# EAGLE schematic 3.3 (EAGLE 9.3.0)

## Sheet 1 of 3
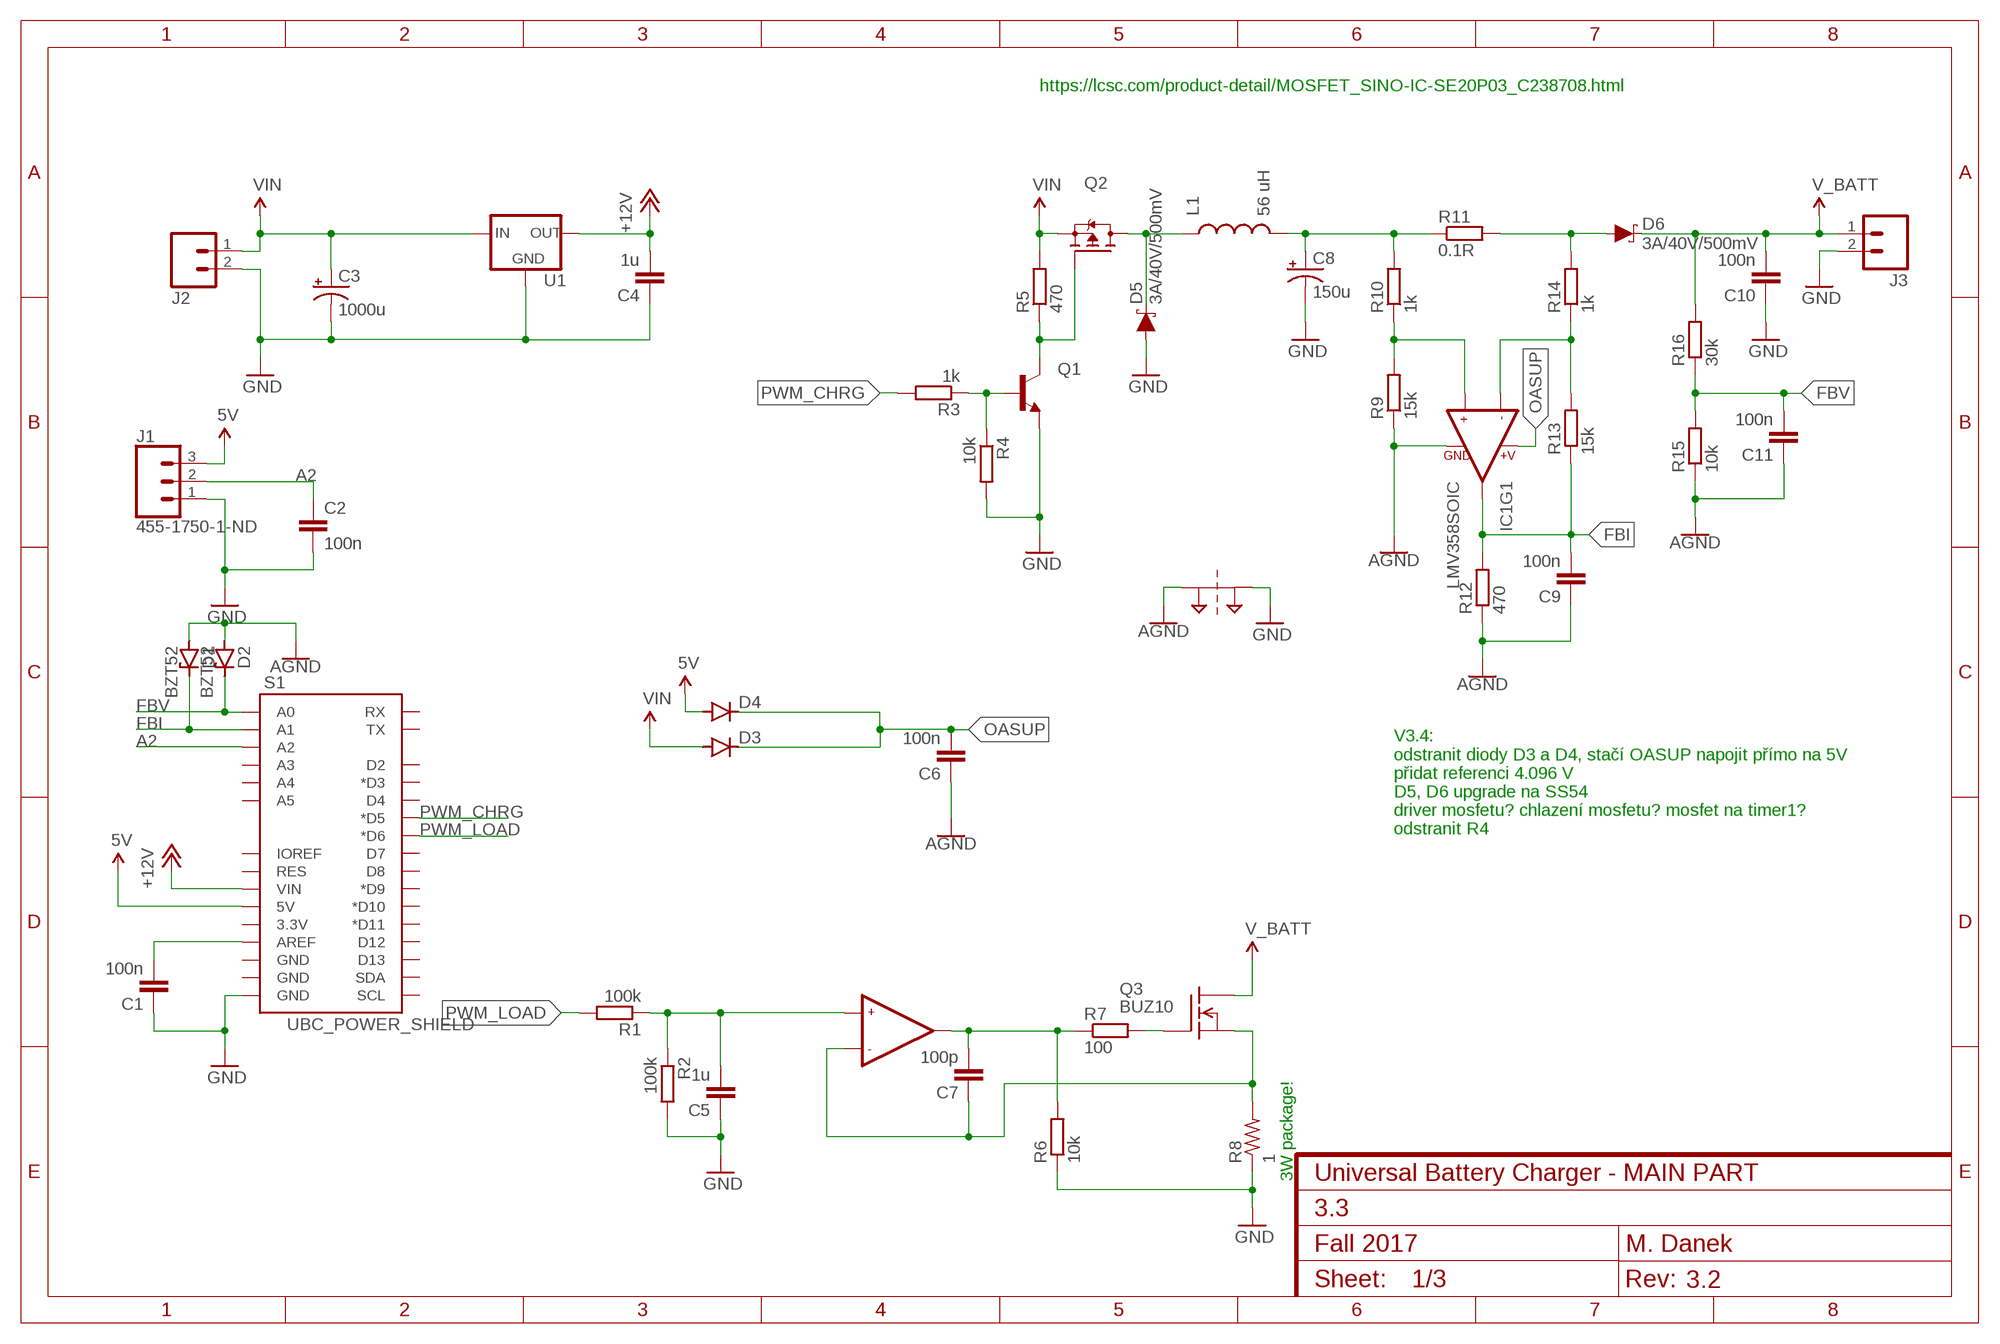
[diagram p0: schematic, sheet 1]
FRAME1 (FRAME-A4L): CNAME: Universal Battery Charger - MAIN PART; CREVISION: 3.2; DESIGNER: M. Danek

### Parts
C1  100n  C-EUC1206  [C1206]
C2  100n  C-EUC1206  [C1206]
C3  1000u  CAP_POLPTH4  [CPOL-RADIAL-1000UF-25V]
C4  1u  C-EUC1206  [C1206]
C5  1u  C-EUC1206  [C1206]
C6  100n  C-EUC1206  [C1206]
C7  100p  C-EUC1206  [C1206]
C8  150u  CAP_POLPTH1  [CPOL-RADIAL-100UF-25V]
C9  100n  C-EUC1206  [C1206]
C10  100n  C-EUC1206  [C1206]
C11  100n  C-EUC1206  [C1206]
D1  BZT52  ZENER-DIODESOD80C  [SOD80C]
D2  BZT52  ZENER-DIODESOD80C  [SOD80C]
D3  DIODE-MINIMELF  [MINIMELF]
D4  DIODE-MINIMELF  [MINIMELF]
D5  3A/40V/500mV  DIODE-SCHOTTKY-B340A  [SMA-DIODE]
D6  3A/40V/500mV  DIODE-SCHOTTKY-B340A  [SMA-DIODE]
IC1  LMV358SOIC  [SO08]
J1  455-1750-1-ND  CONN_03  [1X03]
J2  M025MM  [SCREWTERMINAL-5MM-2]
J3  M025MM  [SCREWTERMINAL-5MM-2]
L1  56 uH  INDUCTORPWR  [CDRH125]
PT1  2PT_GND_TIE  [2PT_GND_TIE]
Q1  2N3904-MMBT  [SOT23]
Q2  FDD4141TO252  [TO252]
Q3  BUZ10  [TO220]
R1  100k  R-EU_R1206  [R1206]
R2  100k  R-EU_R1206  [R1206]
R3  1k  R-EU_R1206  [R1206]
R4  10k  R-EU_R1206  [R1206]
R5  470  R-EU_R1206  [R1206]
R6  10k  R-EU_R1206  [R1206]
R7  100  R-EU_R1206  [R1206]
R8  1  R-US_0617/22  [0617/22]
R9  15k  R-EU_R1206  [R1206]
R10  1k  R-EU_R1206  [R1206]
R11  0.1R  R-EU_0414/15  [0414/15]
R12  470  R-EU_R1206  [R1206]
R13  15k  R-EU_R1206  [R1206]
R14  1k  R-EU_R1206  [R1206]
R15  10k  R-EU_R1206  [R1206]
R16  30k  R-EU_R1206  [R1206]
S1  UBC_POWER_SHIELD  [UBC_POWER]
U1  V_REG_78XXSIDE  [78XXL]

### Nets
5V: D4.A J1.3 S1.5V ; also sheet 2,3
+12V: C4.2 S1.VIN U1.OUT
A2: C2.1 J1.2 S1.A2
AGND: C6.1 C9.1 C11.1 D1.A D2.A IC1.4(GND) PT1.P$1 R9.1 R12.1 R15.1
FBI: C9.2 D1.C IC1.1(OUT1) R12.2 R13.1 S1.A1
FBV: C11.2 D2.C R15.2 R16.1 S1.A0
GND: C1.1 C2.2 C3.2(-) C4.1 C5.1 C8.2(-) C10.1 D5.A J1.1 J2.2 J3.2 PT1.P$2 Q1.2(E) R2.2 R4.2 R6.1 R8.1 S1.GND@0(GND) U1.GND ; also sheet 2,3
N$6: C8.1(+) L1.2 R10.2 R11.1
N$7: C1.2 S1.AREF
N$10: IC1.3(+IN1) R9.2 R10.1
N$11: IC1.2(-IN1) R13.2 R14.1
N$14: D5.C L1.1 Q2.3(D)
N$15: D6.A R11.2 R14.2
N$21: C7.2 IC1.7(OUT2) R6.2 R7.1
N$23: Q1.3(C) Q2.1(G) R5.1
N$24: Q3.1(G) R7.2
N$25: C7.1 IC1.6(-IN2) Q3.3(S) R8.2
N$26: C5.2 IC1.5(+IN2) R1.1 R2.1
N$31: Q1.1(B) R3.1 R4.1
OASUP: C6.2 D3.C D4.C IC1.8(+V)
PWM_CHRG: R3.2 S1.D5(*D5)
PWM_LOAD: R1.2 S1.D6(*D6)
V_BATT: C10.2 D6.C J3.1 Q3.2(D) R16.2
VIN: C3.1(+) D3.A J2.1 Q2.2(S) R5.2 U1.IN
Unconnected: S1.3.3V S1.A3 S1.A4 S1.A5 S1.D2 S1.D3(*D3) S1.D4 S1.D7 S1.D8 S1.D9(*D9) S1.D10(*D10) S1.D11(*D11) S1.D12 S1.D13 S1.GND@1(GND) S1.GND@2(GND) S1.IOREF S1.RES S1.RX S1.SCL S1.SDA S1.TX

### Notes on the sheet
- https://lcsc.com/product-detail/MOSFET_SINO-IC-SE20P03_C238708.html
- V3.4: 
  odstranit diody D3 a D4, stačí OASUP napojit přímo na 5V
  přidat referenci 4.096 V
  D5, D6 upgrade na SS54
  driver mosfetu? chlazení mosfetu? mosfet na timer1?
  odstranit R4
- 3W package!
- Fall 2017

## Sheet 2 of 3
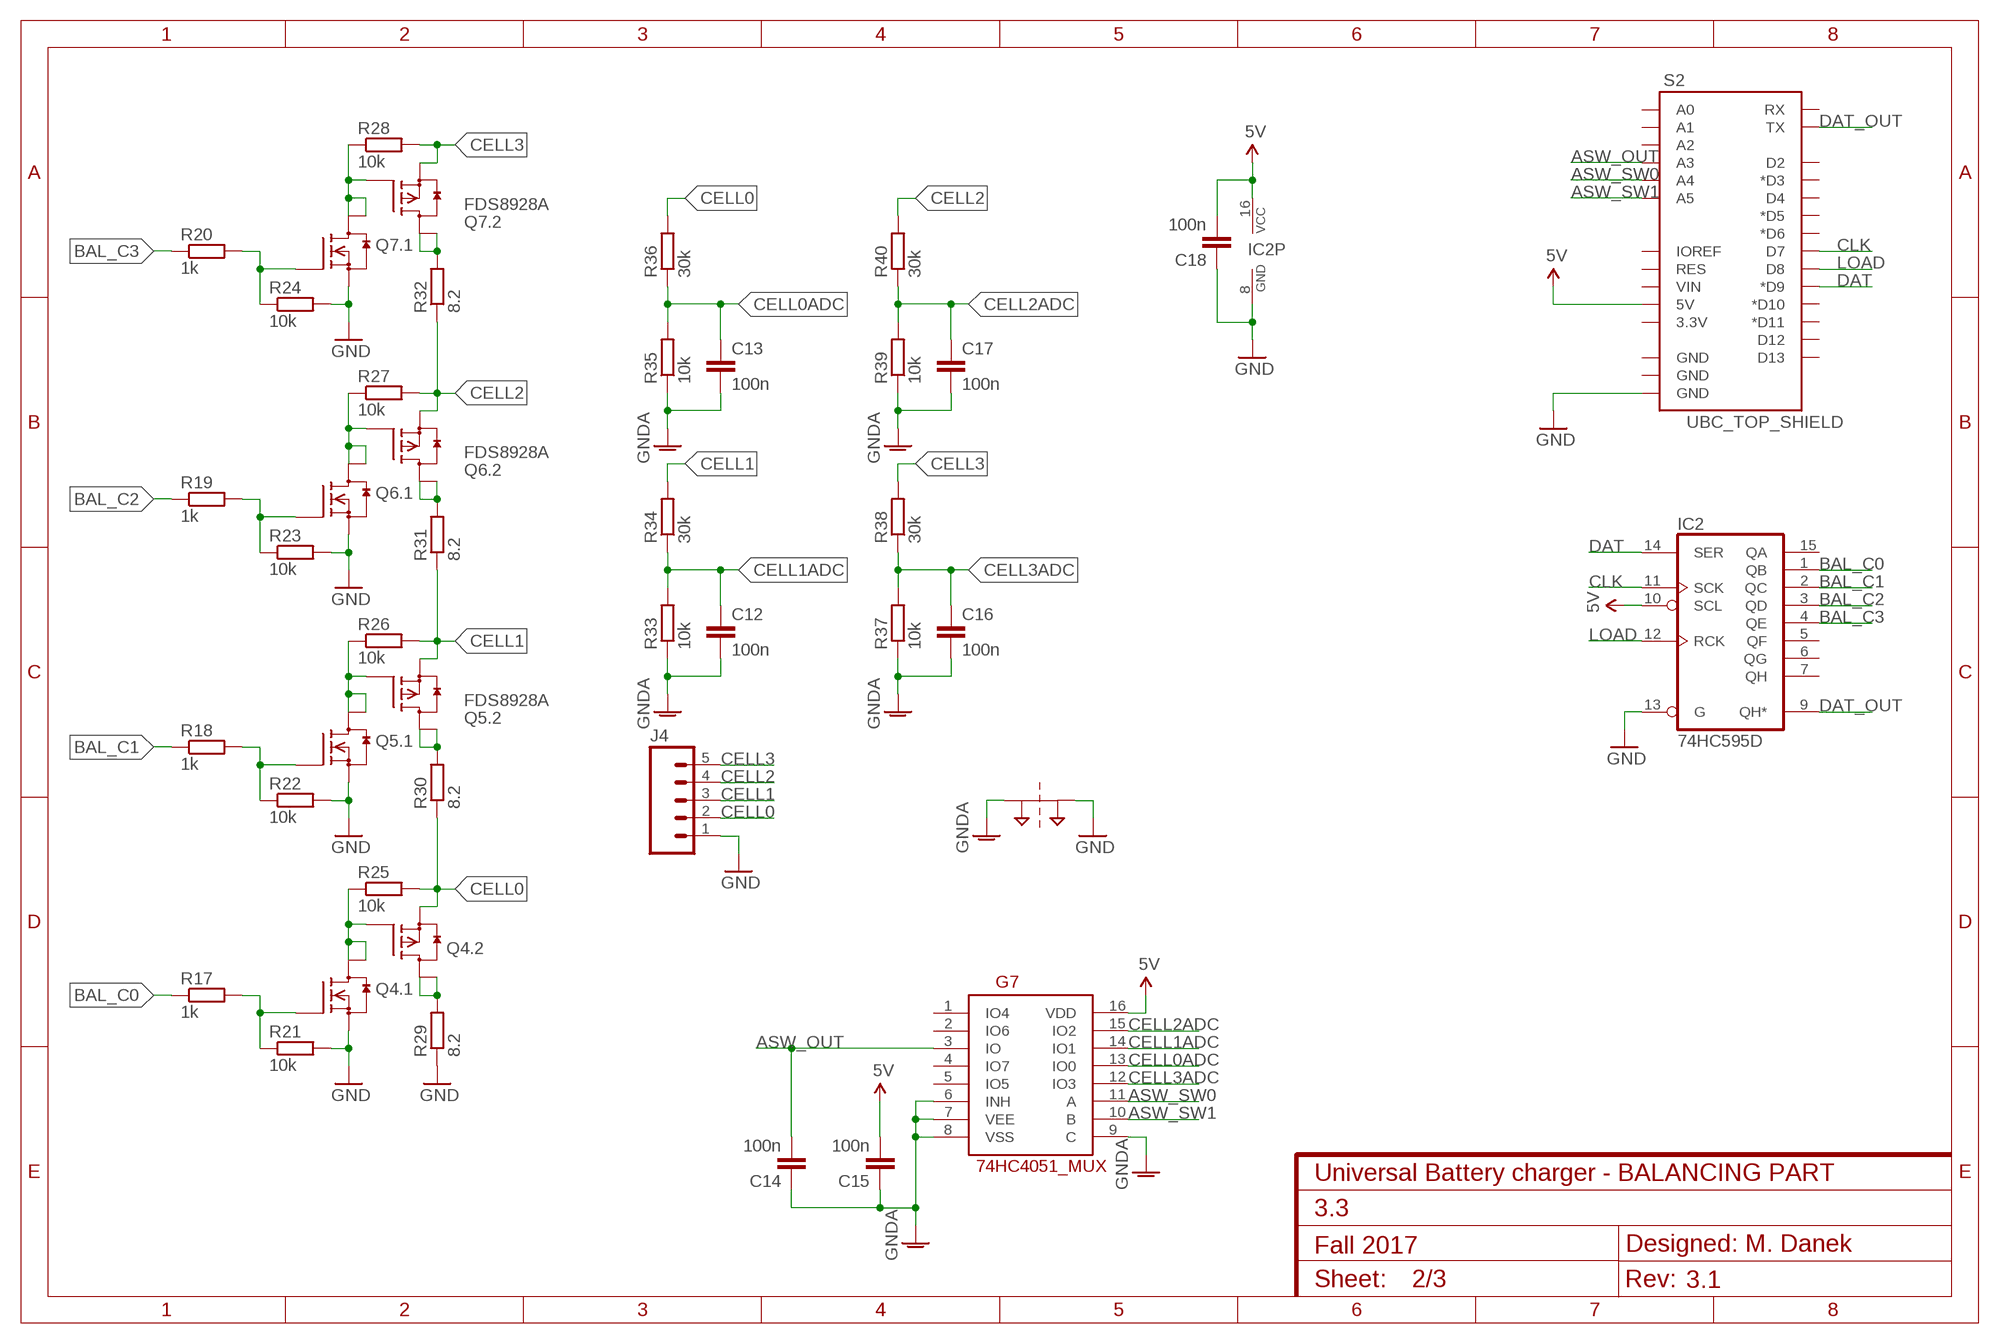
[diagram p1: schematic, sheet 2]
FRAME2 (FRAME-A4L): CNAME: Universal Battery charger - BALANCING PART; CREVISION: 3.1; DESIGNER: Designed: M. Danek

### Parts
C12  100n  C-EUC1206  [C1206]
C13  100n  C-EUC1206  [C1206]
C14  100n  C-EUC1206  [C1206]
C15  100n  C-EUC1206  [C1206]
C16  100n  C-EUC1206  [C1206]
C17  100n  C-EUC1206  [C1206]
C18  100n  CAP1206  [1206]
G7  74HC4051_MUX  [SO16]
IC2  74HC595D  [SO16]
J4  M05PTH  [1X05]
PT2  2PT_GND_TIE  [2PT_GND_TIE]
Q4  FDS8928A  [SO-8]
Q5  FDS8928A  [SO-8]
Q6  FDS8928A  [SO-8]
Q7  FDS8928A  [SO-8]
R17  1k  R-EU_R1206  [R1206]
R18  1k  R-EU_R1206  [R1206]
R19  1k  R-EU_R1206  [R1206]
R20  1k  R-EU_R1206  [R1206]
R21  10k  R-EU_R1206  [R1206]
R22  10k  R-EU_R1206  [R1206]
R23  10k  R-EU_R1206  [R1206]
R24  10k  R-EU_R1206  [R1206]
R25  10k  R-EU_R1206  [R1206]
R26  10k  R-EU_R1206  [R1206]
R27  10k  R-EU_R1206  [R1206]
R28  10k  R-EU_R1206  [R1206]
R29  8.2  R-EU_R2512  [R2512]
R30  8.2  R-EU_R2512  [R2512]
R31  8.2  R-EU_R2512  [R2512]
R32  8.2  R-EU_R2512  [R2512]
R33  10k  R-EU_R1206  [R1206]
R34  30k  R-EU_R1206  [R1206]
R35  10k  R-EU_R1206  [R1206]
R36  30k  R-EU_R1206  [R1206]
R37  10k  R-EU_R1206  [R1206]
R38  30k  R-EU_R1206  [R1206]
R39  10k  R-EU_R1206  [R1206]
R40  30k  R-EU_R1206  [R1206]
S2  UBC_TOP_SHIELD  [UBC_TOP]

### Nets
5V: C15.2 C18.2 G7.16(VDD) IC2.10(SCL) IC2.16(VCC) S2.5V ; also sheet 1,3
ASW_OUT: C14.2 G7.3(IO) S2.A3
ASW_SW0: G7.11(A) S2.A4
ASW_SW1: G7.10(B) S2.A5
BAL_C0: IC2.1(QB) R17.1
BAL_C1: IC2.2(QC) R18.1
BAL_C2: IC2.3(QD) R19.1
BAL_C3: IC2.4(QE) R20.1
CELL0: J4.2 Q4.3(.2:S) R25.2 R30.1 R36.2
CELL0ADC: C13.1 G7.13(IO0) R35.2 R36.1
CELL1: J4.3 Q5.3(.2:S) R26.2 R31.1 R34.2
CELL1ADC: C12.1 G7.14(IO1) R33.2 R34.1
CELL2: J4.4 Q6.3(.2:S) R27.2 R32.1 R40.2
CELL2ADC: C17.1 G7.15(IO2) R39.2 R40.1
CELL3: J4.5 Q7.3(.2:S) R28.2 R38.2
CELL3ADC: C16.1 G7.12(IO3) R37.2 R38.1
CLK: IC2.11(SCK) S2.D7
DAT: IC2.14(SER) S2.D9(*D9)
DAT_OUT: IC2.9(QH*) S2.TX
GND: C18.1 IC2.8(GND) IC2.13(G) J4.1 PT2.P$2 Q4.1(.1:S) Q5.1(.1:S) Q6.1(.1:S) Q7.1(.1:S) R21.2 R22.2 R23.2 R24.2 R29.1 S2.GND@0(GND) ; also sheet 1,3
GNDA: C12.2 C13.2 C14.1 C15.1 C16.2 C17.2 G7.6(INH) G7.7(VEE) G7.8(VSS) G7.9(C) PT2.P$1 R33.1 R35.1 R37.1 R39.1
LOAD: IC2.12(RCK) S2.D8
N$2: Q4.2(.1:G) R17.2 R21.1
N$3: Q4.5(.2:D) Q4.6(.2:D) R29.2
N$4: Q5.2(.1:G) R18.2 R22.1
N$5: Q5.4(.2:G) Q5.7(.1:D) Q5.8(.1:D) R26.1
N$8: Q5.5(.2:D) Q5.6(.2:D) R30.2
N$9: Q6.2(.1:G) R19.2 R23.1
N$12: Q6.4(.2:G) Q6.7(.1:D) Q6.8(.1:D) R27.1
N$13: Q6.5(.2:D) Q6.6(.2:D) R31.2
N$17: Q7.2(.1:G) R20.2 R24.1
N$18: Q7.4(.2:G) Q7.7(.1:D) Q7.8(.1:D) R28.1
N$19: Q7.5(.2:D) Q7.6(.2:D) R32.2
N$20: Q4.4(.2:G) Q4.7(.1:D) Q4.8(.1:D) R25.1
Unconnected: G7.1(IO4) G7.2(IO6) G7.4(IO7) G7.5(IO5) IC2.5(QF) IC2.6(QG) IC2.7(QH) IC2.15(QA) S2.3.3V S2.A0 S2.A1 S2.A2 S2.D2 S2.D3(*D3) S2.D4 S2.D5(*D5) S2.D6(*D6) S2.D10(*D10) S2.D11(*D11) S2.D12 S2.D13 S2.GND@1(GND) S2.GND@2(GND) S2.IOREF S2.RES S2.RX S2.VIN

### Notes on the sheet
- Fall 2017

## Sheet 3 of 3
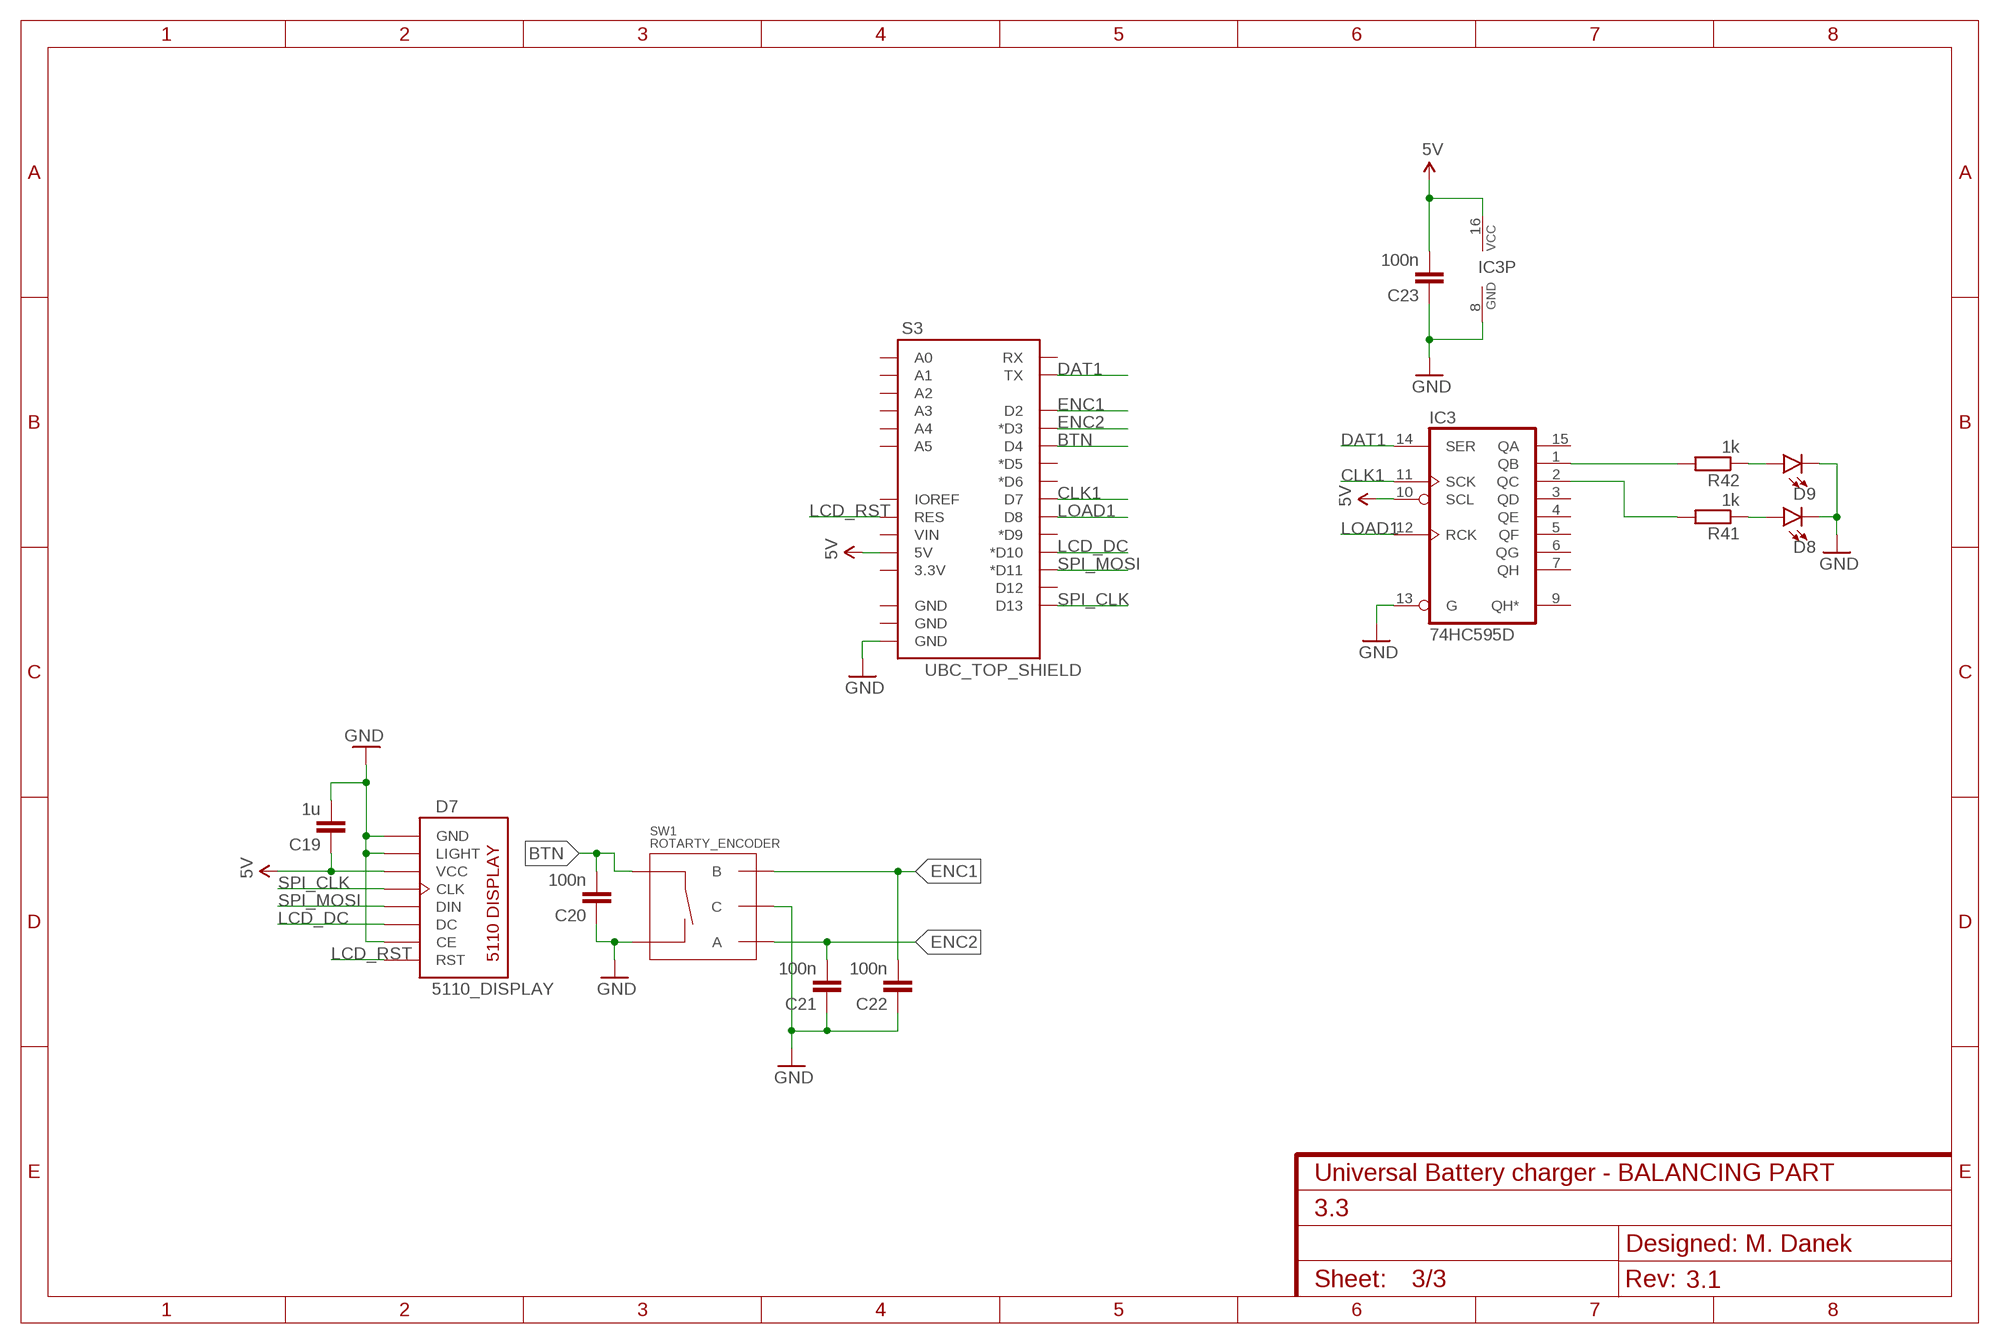
[diagram p2: schematic, sheet 3]
FRAME3 (FRAME-A4L): CNAME: Universal Battery charger - BALANCING PART; CREVISION: 3.1; DESIGNER: Designed: M. Danek

### Parts
C19  1u  CAP1206  [1206]
C20  100n  CAP1206  [1206]
C21  100n  CAP1206  [1206]
C22  100n  CAP1206  [1206]
C23  100n  CAP1206  [1206]
D7  5110_DISPLAY  [5110_LAYOUT]
D8  LED5MM  [LED_5MM]
D9  LED5MM  [LED_5MM]
IC3  74HC595D  [SO16]
R41  1k  R-EU_R1206  [R1206]
R42  1k  R-EU_R1206  [R1206]
S3  UBC_TOP_SHIELD  [UBC_TOP]
SW1  ROTARTY_ENCODER  [ROTARY_ENC_PLAIN]

### Nets
5V: C19.1 C23.2 D7.VCC IC3.10(SCL) IC3.16(VCC) S3.5V ; also sheet 1,2
BTN: C20.2 S3.D4 SW1.SW+
CLK1: IC3.11(SCK) S3.D7
DAT1: IC3.14(SER) S3.TX
ENC1: C22.2 S3.D2 SW1.B
ENC2: C21.2 S3.D3(*D3) SW1.A
GND: C19.2 C20.1 C21.1 C22.1 C23.1 D7.CE D7.GND D7.LIGHT D8.K(C) D9.K(C) IC3.8(GND) IC3.13(G) S3.GND@0(GND) SW1.C SW1.SW- ; also sheet 1,2
LCD_DC: D7.DC S3.D10(*D10)
LCD_RST: D7.RST S3.RES
LOAD1: IC3.12(RCK) S3.D8
N$16: IC3.1(QB) R42.2
N$27: IC3.2(QC) R41.2
N$28: D9.A R42.1
N$29: D8.A R41.1
SPI_CLK: D7.CLK S3.D13
SPI_MOSI: D7.DIN S3.D11(*D11)
Unconnected: IC3.3(QD) IC3.4(QE) IC3.5(QF) IC3.6(QG) IC3.7(QH) IC3.9(QH*) IC3.15(QA) S3.3.3V S3.A0 S3.A1 S3.A2 S3.A3 S3.A4 S3.A5 S3.D5(*D5) S3.D6(*D6) S3.D9(*D9) S3.D12 S3.GND@1(GND) S3.GND@2(GND) S3.IOREF S3.RX S3.VIN

## Library data of the parts
C1 C2 C4-C7 C9-C17 = resistor:C-EU: CAPACITOR, European symbol
C3 = SparkFun-Passives:CAP_POL: Capacitor Polarized These are standard SMD and PTH capacitors. Normally 10uF, 47uF, and 100uF in electrolytic and tantalum varieties. Always verify the external diameter of the through hole cap, it varies with capacity, voltage, and manufacturer. The EIA devices should be standard.
C8 = SparkFun-Capacitors:CAP_POL: Capacitor Polarized These are standard SMD and PTH capacitors. Normally 10uF, 47uF, and 100uF in electrolytic and tantalum varieties. Always verify the external diameter of the through hole cap, it varies with capacity, voltage, and manufacturer. The EIA devices should be standard.
C18-C23 = SparkFun-Capacitors:CAP: Capacitor Standard 0603 ceramic capacitor, and 0.1" leaded capacitor.
D1 D2 = diode:ZENER-DIODE: Z-Diode
D3 D4 = diode:DIODE-: DIODE
D5 D6 = SparkFun-DiscreteSemi:DIODE-SCHOTTKY: Schottky diode A Schottky diode is a semiconductor diode which has a low forward voltage drop and a very fast switching action.; PROD_ID: DIO-09886
D7 = custom:5110_DISPLAY
D8 D9 = SparkFun-LED:LED: LED (Generic) Standard schematic elements and footprints for 5mm, 3mm, 1206, and 0603 sized LEDs. Generic LEDs with no color specified.
G7 = SparkFun-AnalogIC:74HC4051_MUX: 8:1 analog mux
IC1 = SparkFun-AnalogIC:LMV358: Jellybean rail-to-rail output op-amp; PROD_ID: IC-09657
IC2 IC3 = 74xx-eu:74*595: 8-bit SHIFT REGISTER, output latch
J1 = SparkFun-Connectors:CONN_03: Multi connection point. Often used as Generic Header-pin footprint for 0.1 inch spaced/style header connections On any of the 0.1 inch spaced packages, you can populate with these: Break Away Headers - Straight <https://www.sparkfun.com/products/116> (PRT-00116) Break Away Male Headers - Right Angle <https://www.sparkfun.com/products/553> (PRT-00553) Female Headers <https://www.sparkfun.com/products/115> (PRT-00115) Break Away Headers - Machine Pin <https://www.sparkfun.com/products/117> (PRT-00117) Break Away Female Headers - Swiss Machine Pin <https://www.sparkfun.com/products/743> (PRT-00743) Stackable Header - 3 Pin (Female, 0.1") <https://www.sparkfun.com/products/13875> (PRT-13875) For SCREWTERMINALS and SPRING TERMINALS visit here: Screw Terimnals on SparkFun.com <https://www.sparkfun.com/search/results?term=Screw+Terminals> (5mm/3.5mm/2.54mm spacing) This device is also useful as a general connection point to wire up your design to another part of your project. Our various solder wires solder well into these plated through hole pads. Hook-Up Wire - Assortment (Stranded, 22 AWG) <https://www.sparkfun.com/products/11375> (PRT-11375) Hook-Up Wire - Assortment (Solid Core, 22 AWG) <https://www.sparkfun.com/products/11367> (PRT-11367) View the entire wire category on our website here <https://www.sparkfun.com/categories/141> Special notes: Molex polarized connector foot print use with SKU : PRT-08232 with associated crimp pins and housings.; PROD_ID: XXX-00000
J2 J3 = SparkFun-Connectors:M02: Standard 2-pin 0.1" header. Use with - straight break away headers ( PRT-00116) - right angle break away headers (PRT-00553) - swiss pins (PRT-00743) - machine pins (PRT-00117) - female headers (PRT-00115) Molex polarized connector foot print use with: PRT-08233 with associated crimp pins and housings. 2.54_SCREWTERM for use with PRT-10571. 3.5mm Screw Terminal footprints for PRT-08084 5mm Screw Terminal footprints for use with PRT-08432; STOREFRONT_ID: PRT-08432
J4 = SparkFun-Connectors:M05: Header 5 Standard 5-pin 0.1" header. Use with straight break away headers (SKU : PRT-00116), right angle break away headers (PRT-00553), swiss pins (PRT-00743), machine pins (PRT-00117), and female headers (PRT-00115). Molex polarized connector foot print use with SKU : PRT-08230 with associated crimp pins and housings.
L1 = SparkFun-Passives:INDUCTOR: Inductors Basic Inductor/Choke - 0603 and 1206. Footprints are not proven and vary greatly between part numbers. INDUCTOR POWER 3.3UH 4.0A SMD 0.197" L x 0.197" W x 0.177" H (5.00mm x 5.00mm x 4.50mm)
PT1 PT2 = SparkFun-Passives:2PT_GND_TIE: Package for connecting two ground nets in one place.
Q1 = m-pad-2.1:2N3904: NPN TRANSISTOR
Q2 = transistor-fet:FDD4141: P-Channel PowerTrench® MOSFET Source: FDD4141.pdf
Q3 = transistor-fet:BUZ10: N-Channel Enhancement MOSFET 50V; 20A; 0,080Ohm
Q4-Q7 = m-pad-2.1:FDS8928A: Fairchild's FDS8928A Dual N & P-Channel Enhancement Mode Field Effect Transistor General Description: These dual N- and P -Channel enhancement mode power field effect transistors are produced using Fairchild's proprietary, high cell density, DMOS technology. This very high density process is especially tailored to minimize on-state resistance and provide superior switching performance. These devices are particularly suited for low voltage applications such as notebook computer power management and other battery powered circuits where fast switching, low in-line power loss, and resistance to transients are needed. Features: N-Channel 5.5 A,30 V, RDS(ON)=0.030 W @ VGS=4.5 V RDS(ON)=0.038 W @ VGS=2.5 V. P-Channel -4 A,-20 V, RDS(ON)=0.055 W @ VGS=-4.5 V RDS(ON)=0.072 W @ VGS=-2.5 V. High density cell design for extremely low RDS(ON). High power and current handling capability in a widely used surface mount package. Dual (N & P-Channel) MOSFET in surface mount package. Please send any comments to: messi@users.sourceforge.net
R1-R7 R9-R42 = resistor:R-EU_: RESISTOR, European symbol
R8 = resistor:R-US_: RESISTOR, American symbol
S1 = custom:UBC_POWER_SHIELD
S2 S3 = custom:UBC_TOP_SHIELD
SW1 = SparkFun-Electromechanical:ROTARTY_ENCODER: Simple no LED rotary encoder Example: COM-09117
U1 = SparkFun-PowerIC:V_REG_78XX: Voltage Regulator Standard 78xx regulator. IGO (Input Ground Output). Spark Fun Electronics SKU : COM-00107